# Altium schematic sheet OZ440-SE100-CAR003_Sheet1.SchDoc: mezzanine CAN pour ODROID XU
size A3; Date: 08/04/14; CheckedBy: GS; Author: BM; DocumentNumber: OZ440-SE100-CAR001-SCH01; Revision: 2V; SheetNumber: 1; SheetTotal: 1
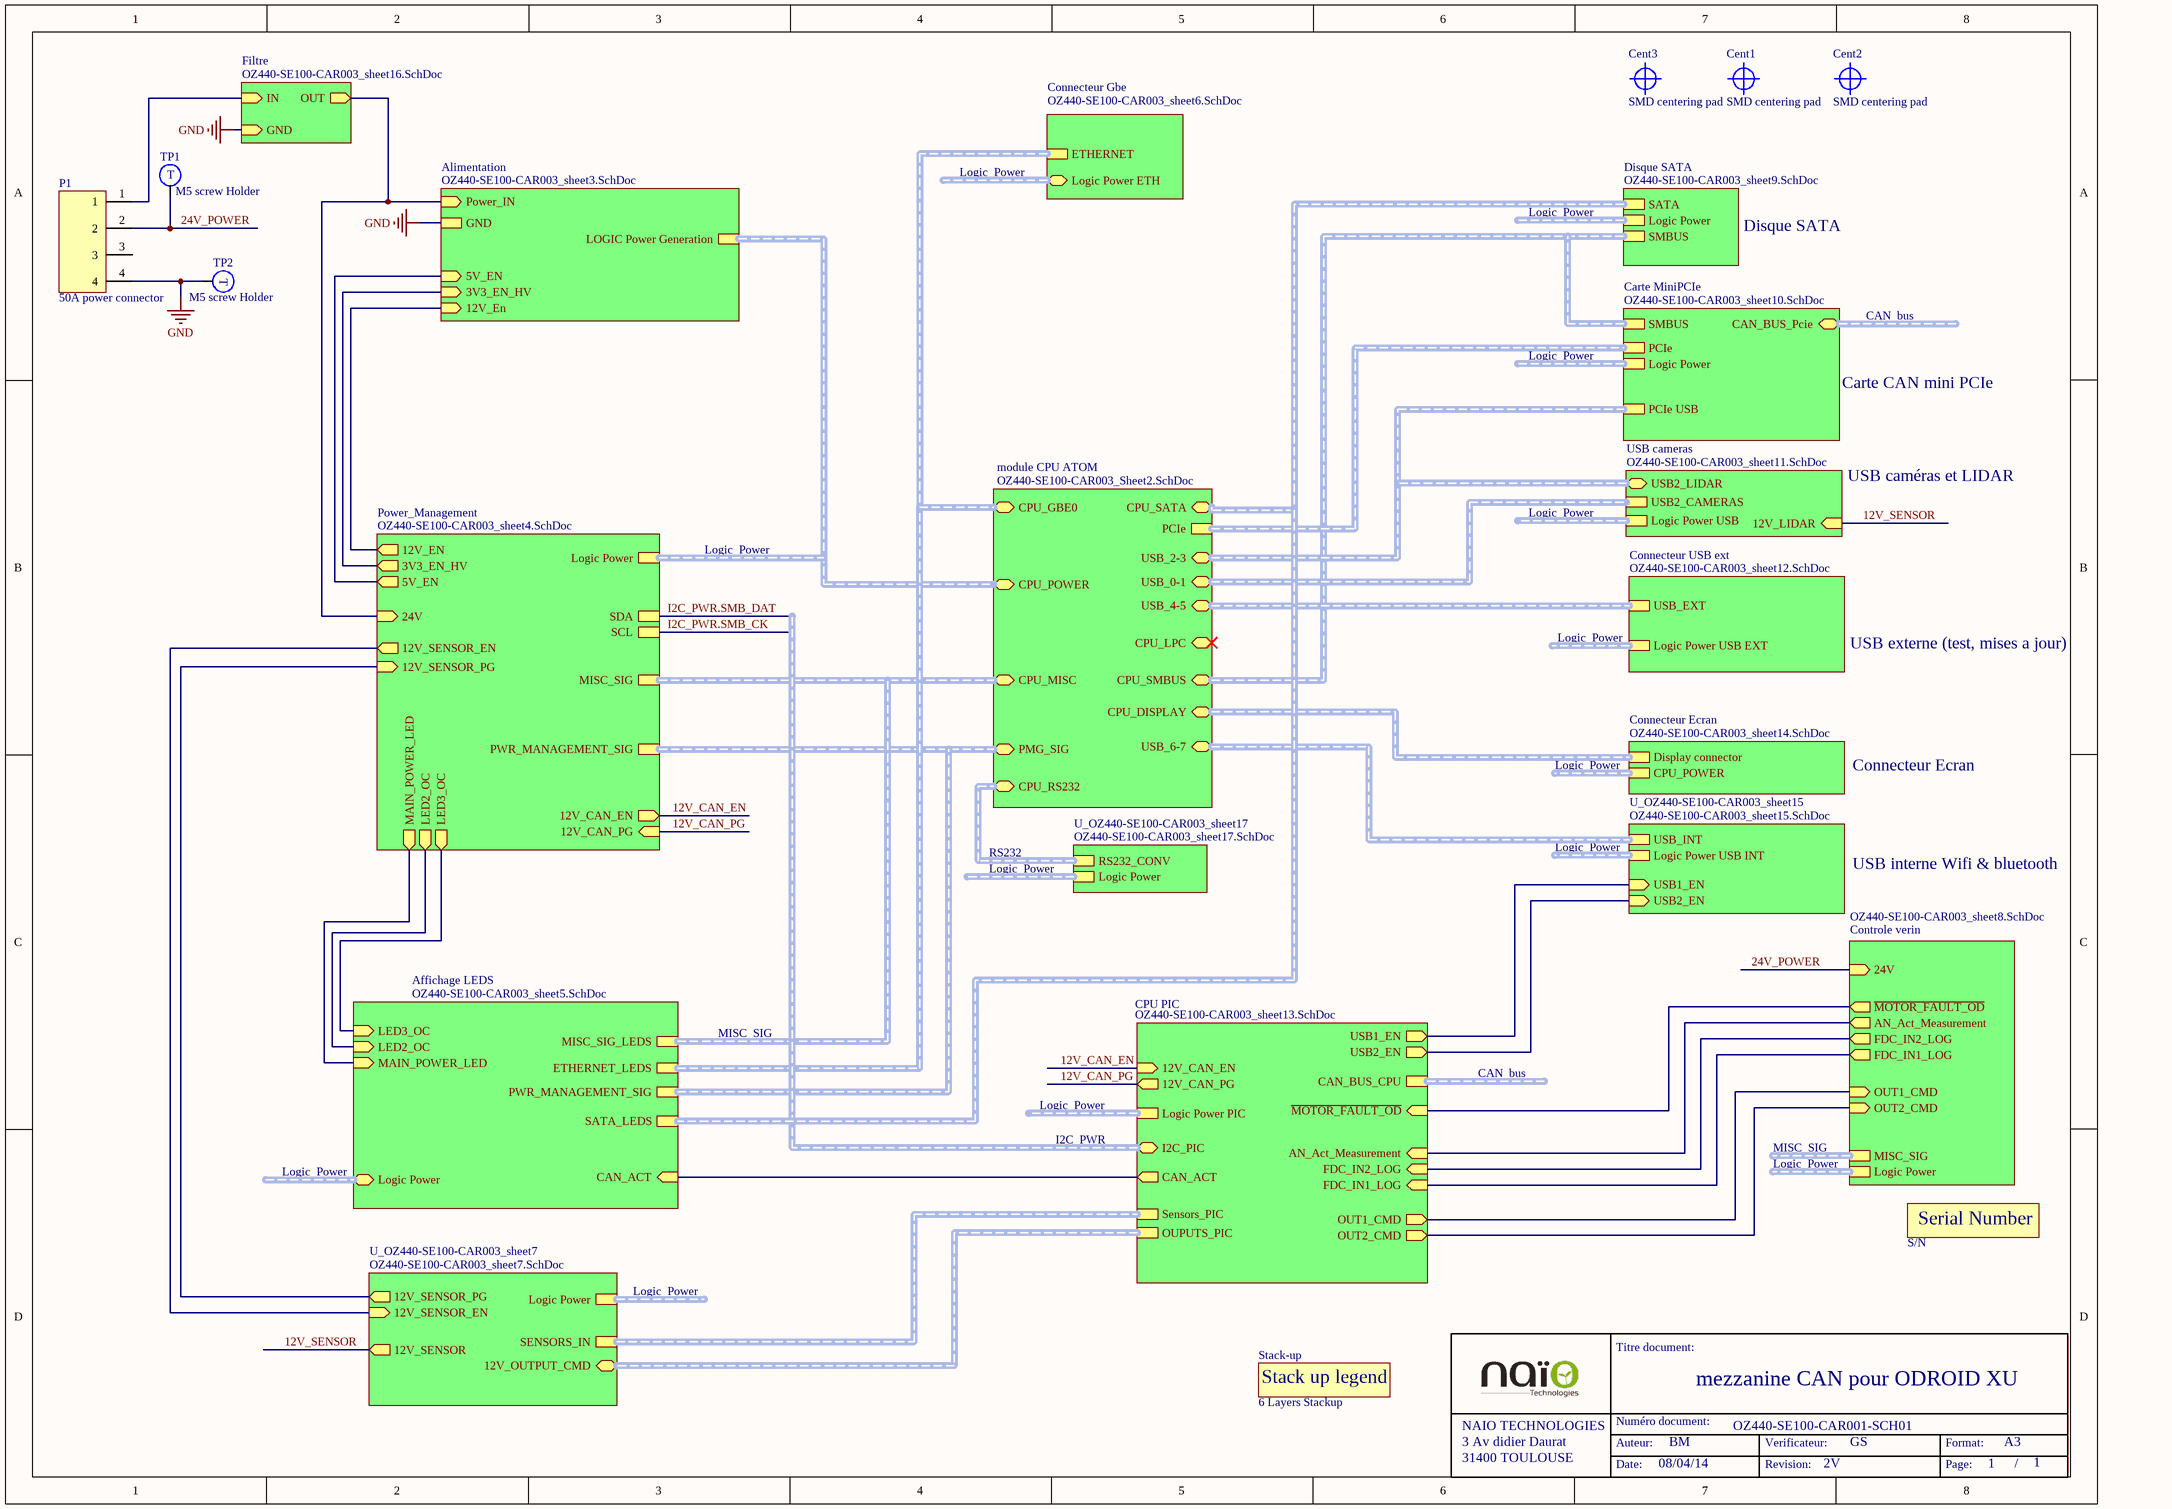
[diagram p0: OZ440-SE100-CAR003_Sheet1.SchDoc]

## Parts
Cent1  MEC-STD-CENTER  [MEC-STD-CENTER]  (value not drawn)  (no BOM)
Cent2  MEC-STD-CENTER  [MEC-STD-CENTER]  (value not drawn)  (no BOM)
Cent3  MEC-STD-CENTER  [MEC-STD-CENTER]  (value not drawn)  (no BOM)
P1  Displayed reference: 50A power connector  [CONN-SPE-428204213_MOLEX]  (hidden comment: CONN-STD-4P_puissance)
SN1  Displayed reference: S/N  [SERIAL_NUMBER-STD]  (hidden comment: SERIAL-NUMBER)
Stack-up  Displayed reference: 6 Layers Stackup  [STACKUP-SPE-6LAYERS]  (hidden comment: STACKUP)  (no BOM)
TP1  Displayed reference: M5 screw Holder  [MEC-SPE-WURTHZ_7460408]  (hidden comment: TP-STD-TEST_POINT)
TP2  Displayed reference: M5 screw Holder  [MEC-SPE-WURTHZ_7460408]  (hidden comment: TP-STD-TEST_POINT)

## Sub-sheets
Affichage LEDS = OZ440-SE100-CAR003_sheet5.SchDoc: SATA_LEDS (harness SATA), ETHERNET_LEDS (harness ETHERNET), MISC_SIG_LEDS (harness MISC_SIG), MAIN_POWER_LED (in), PWR_MANAGEMENT_SIG (harness PWR_MANAGEMENT_SIG), CAN_ACT (in), LED2_OC (in), LED3_OC (in), Logic Power (harness Logic Power)
Alimentation = OZ440-SE100-CAR003_sheet3.SchDoc: Power_IN (in), 12V_En (in), GND, 5V_EN (in), LOGIC Power Generation (harness Logic Power), 3V3_EN_HV (in)
Carte MiniPCIe = OZ440-SE100-CAR003_sheet10.SchDoc: PCIe (harness PCIe), Logic Power (harness Logic Power), SMBUS (harness SMBUS), PCIe USB (harness USB2_DUAL), CAN_BUS_Pcie (harness CAN_BUS)
Connecteur Ecran = OZ440-SE100-CAR003_sheet14.SchDoc: Display connector (harness Display), CPU_POWER (harness Logic Power)
Connecteur Gbe = OZ440-SE100-CAR003_sheet6.SchDoc: ETHERNET (harness ETHERNET), Logic Power ETH (harness Logic Power)
Connecteur USB ext = OZ440-SE100-CAR003_sheet12.SchDoc: USB_EXT (harness USB2_DUAL), Logic Power USB EXT (harness Logic Power)
Controle verin = OZ440-SE100-CAR003_sheet8.SchDoc: 24V (in), OUT1_CMD (in), OUT2_CMD (in), MISC_SIG (harness MISC_SIG), ~{MOTOR_FAULT_OD} (out), Logic Power (harness Logic Power), AN_Act_Measurement (out), FDC_IN2_LOG (out), FDC_IN1_LOG (out)
CPU PIC = OZ440-SE100-CAR003_sheet13.SchDoc: CAN_BUS_CPU (harness CAN_BUS), Logic Power PIC (harness Logic Power), OUPUTS_PIC (harness OUPUTS), Sensors_PIC (harness Sensors), OUT1_CMD (out), OUT2_CMD (out), AN_Act_Measurement (in), FDC_IN2_LOG (in), FDC_IN1_LOG (in), ~{MOTOR_FAULT_OD} (in), I2C_PIC (harness SMBUS), CAN_ACT (out), 12V_CAN_EN (in), 12V_CAN_PG (out), USB1_EN (out), USB2_EN (out)
Disque SATA = OZ440-SE100-CAR003_sheet9.SchDoc: SATA (harness SATA), Logic Power (harness Logic Power), SMBUS (harness SMBUS)
Filtre = OZ440-SE100-CAR003_sheet16.SchDoc: IN (in), OUT (out), GND (in)
module CPU ATOM = OZ440-SE100-CAR003_Sheet2.SchDoc: PCIe (harness PCIe), CPU_POWER (harness Logic Power), CPU_DISPLAY (harness Display), CPU_GBE0 (harness ETHERNET), USB_0-1 (harness USB2_DUAL), USB_2-3 (harness USB2_DUAL), CPU_SATA (harness SATA), CPU_LPC (harness LPC_BUS), PMG_SIG (harness PWR_MANAGEMENT_SIG), CPU_MISC (harness MISC_SIG), CPU_RS232 (harness RS232), CPU_SMBUS (harness SMBUS), USB_4-5 (harness USB2_DUAL), USB_6-7 (harness USB2_DUAL)
Power_Management = OZ440-SE100-CAR003_sheet4.SchDoc: Logic Power (harness Logic Power), SCL, SDA, 24V (in), PWR_MANAGEMENT_SIG (harness PWR_MANAGEMENT_SIG), MISC_SIG (harness MISC_SIG), 3V3_EN_HV (out), 12V_EN (out), 5V_EN (out), 12V_SENSOR_EN (out), 12V_CAN_EN (out), MAIN_POWER_LED (out), LED2_OC (out), LED3_OC (out), 12V_SENSOR_PG (in), 12V_CAN_PG (in)
U_OZ440-SE100-CAR003_sheet7 = OZ440-SE100-CAR003_sheet7.SchDoc: Logic Power (harness Logic Power), 12V_SENSOR_EN (in), 12V_SENSOR_PG (out), SENSORS_IN (harness Sensors), 12V_OUTPUT_CMD (harness OUPUTS), 12V_SENSOR (out)
U_OZ440-SE100-CAR003_sheet15 = OZ440-SE100-CAR003_sheet15.SchDoc: USB_INT (harness USB2_DUAL), Logic Power USB INT (harness Logic Power), USB1_EN (in), USB2_EN (in)
U_OZ440-SE100-CAR003_sheet17 = OZ440-SE100-CAR003_sheet17.SchDoc: RS232_CONV (harness RS232), Logic Power (harness Logic Power)
USB cameras = OZ440-SE100-CAR003_sheet11.SchDoc: Logic Power USB (harness Logic Power), USB2_CAMERAS (harness USB2_DUAL), USB2_LIDAR (harness USB2_DUAL), 12V_LIDAR (in)

## Nets
GND: P1.4 TP2.1(T) ; sheet Alimentation/GND, sheet Filtre/GND
12V_CAN_EN: sheet Power_Management/12V_CAN_EN, sheet CPU PIC/12V_CAN_EN
12V_CAN_PG: sheet Power_Management/12V_CAN_PG, sheet CPU PIC/12V_CAN_PG
12V_SENSOR: sheet U_OZ440-SE100-CAR003_sheet7/12V_SENSOR, sheet USB cameras/12V_LIDAR
24V_POWER: P1.2 TP1.1(T) ; sheet Controle verin/24V
I2C_PWR.SMB_CK: sheet Power_Management/SCL
I2C_PWR.SMB_DAT: sheet Power_Management/SDA
NetP1_1: P1.1 ; sheet Filtre/IN
(unnamed): sheet Alimentation/Power_IN, sheet Power_Management/24V, sheet Filtre/OUT
(unnamed): sheet Alimentation/12V_En, sheet Power_Management/12V_EN
(unnamed): sheet Alimentation/5V_EN, sheet Power_Management/5V_EN
(unnamed): sheet Alimentation/3V3_EN_HV, sheet Power_Management/3V3_EN_HV
(unnamed): sheet Power_Management/12V_SENSOR_EN, sheet U_OZ440-SE100-CAR003_sheet7/12V_SENSOR_EN
(unnamed): sheet Power_Management/MAIN_POWER_LED, sheet Affichage LEDS/MAIN_POWER_LED
(unnamed): sheet Power_Management/LED2_OC, sheet Affichage LEDS/LED2_OC
(unnamed): sheet Power_Management/LED3_OC, sheet Affichage LEDS/LED3_OC
(unnamed): sheet Power_Management/12V_SENSOR_PG, sheet U_OZ440-SE100-CAR003_sheet7/12V_SENSOR_PG
(unnamed): sheet Affichage LEDS/CAN_ACT, sheet CPU PIC/CAN_ACT
(unnamed): sheet Controle verin/OUT1_CMD, sheet CPU PIC/OUT1_CMD
(unnamed): sheet Controle verin/OUT2_CMD, sheet CPU PIC/OUT2_CMD
(unnamed): sheet Controle verin/~{MOTOR_FAULT_OD}, sheet CPU PIC/~{MOTOR_FAULT_OD}
(unnamed): sheet Controle verin/AN_Act_Measurement, sheet CPU PIC/AN_Act_Measurement
(unnamed): sheet Controle verin/FDC_IN2_LOG, sheet CPU PIC/FDC_IN2_LOG
(unnamed): sheet Controle verin/FDC_IN1_LOG, sheet CPU PIC/FDC_IN1_LOG
(unnamed): sheet CPU PIC/USB1_EN, sheet U_OZ440-SE100-CAR003_sheet15/USB1_EN
(unnamed): sheet CPU PIC/USB2_EN, sheet U_OZ440-SE100-CAR003_sheet15/USB2_EN

Not connected (* = marked no-connect by the designer): P1 3

## Buses and harness runs
harness CAN_bus = sheet Carte MiniPCIe/CAN_BUS_Pcie
harness CAN_bus = sheet CPU PIC/CAN_BUS_CPU
harness I2C_PWR = sheet CPU PIC/I2C_PIC
harness Logic_Power = sheet Affichage LEDS/Logic Power
harness Logic_Power = sheet Alimentation/LOGIC Power Generation = sheet module CPU ATOM/CPU_POWER = sheet Power_Management/Logic Power
harness Logic_Power = sheet Carte MiniPCIe/Logic Power
harness Logic_Power = sheet Connecteur Ecran/CPU_POWER
harness Logic_Power = sheet Connecteur Gbe/Logic Power ETH
harness Logic_Power = sheet Connecteur USB ext/Logic Power USB EXT
harness Logic_Power = sheet Controle verin/Logic Power
harness Logic_Power = sheet CPU PIC/Logic Power PIC
harness Logic_Power = sheet Disque SATA/Logic Power
harness Logic_Power = sheet U_OZ440-SE100-CAR003_sheet7/Logic Power
harness Logic_Power = sheet U_OZ440-SE100-CAR003_sheet15/Logic Power USB INT
harness Logic_Power = sheet U_OZ440-SE100-CAR003_sheet17/Logic Power
harness Logic_Power = sheet USB cameras/Logic Power USB
harness MISC_SIG = sheet Affichage LEDS/MISC_SIG_LEDS = sheet module CPU ATOM/CPU_MISC = sheet Power_Management/MISC_SIG
harness MISC_SIG = sheet Controle verin/MISC_SIG
harness RS232 = sheet module CPU ATOM/CPU_RS232 = sheet U_OZ440-SE100-CAR003_sheet17/RS232_CONV
harness sheet Affichage LEDS/ETHERNET_LEDS = sheet Connecteur Gbe/ETHERNET = sheet module CPU ATOM/CPU_GBE0
harness sheet Affichage LEDS/PWR_MANAGEMENT_SIG = sheet module CPU ATOM/PMG_SIG = sheet Power_Management/PWR_MANAGEMENT_SIG
harness sheet Affichage LEDS/SATA_LEDS = sheet Disque SATA/SATA = sheet module CPU ATOM/CPU_SATA
harness sheet Carte MiniPCIe/PCIe = sheet module CPU ATOM/PCIe
harness sheet Carte MiniPCIe/PCIe USB = sheet module CPU ATOM/USB_2-3 = sheet USB cameras/USB2_LIDAR
harness sheet Carte MiniPCIe/SMBUS = sheet Disque SATA/SMBUS = sheet module CPU ATOM/CPU_SMBUS
harness sheet Connecteur Ecran/Display connector = sheet module CPU ATOM/CPU_DISPLAY
harness sheet Connecteur USB ext/USB_EXT = sheet module CPU ATOM/USB_4-5
harness sheet CPU PIC/OUPUTS_PIC = sheet U_OZ440-SE100-CAR003_sheet7/12V_OUTPUT_CMD
harness sheet CPU PIC/Sensors_PIC = sheet U_OZ440-SE100-CAR003_sheet7/SENSORS_IN
harness sheet module CPU ATOM/USB_0-1 = sheet USB cameras/USB2_CAMERAS
harness sheet module CPU ATOM/USB_6-7 = sheet U_OZ440-SE100-CAR003_sheet15/USB_INT

## Notes on the sheet
- Disque SATA
- Carte CAN mini PCIe
- USB caméras et LIDAR
- USB externe (test, mises a jour)
- Connecteur Ecran
- USB interne Wifi & bluetooth
- Titre document:
- NAIO TECHNOLOGIES
- 3 Av didier Daurat
- 31400 TOULOUSE
- Auteur:
- Numéro document:
- Verificateur:
- Format:
- A3
- Date:
- Revision:
- Page:
- /
- (in symbol 6 Layers Stackup) Stack up legend

## Library data of the parts
Cent1-Cent3 = SMD centering pad: Validated: False; Reference: SMD centering pad; Displayed reference: SMD centering pad
P1 = 42820-4213: 4 pin power connector, RA; Manufacturer: Molex; Max Voltage: 600V; Max Current: 50A; Validated: False; Reference: 42820-4213; Footprint description: Thu hole 10mm pitch, RA; Pin Count: 4; Rev: G7; helpURL: http://www.molex.com/pdm_docs/sd/428203213_sd.pdf; Supplier 1: Mouser; Supplier Part Number 1: 538-42820-4213; Supplier 2: Newark; Supplier Part Number 2: 92M0998
SN1 = Serial Number: serial number copper identification; Validated: False; Reference: Serial Number
Stack-up = 6 Layers Stackup: 6 Layers Stackup identification; Validated: False; Reference: 6 Layers Stackup
TP1 TP2 = 7460408: Bush with threaded hole M5; Manufacturer: WURTHZ; Max Current: 160A; Validated: False; Reference: 7460408; Material: CuZn39Pb3; Footprint description: Pressfit Bush with threaded hole M5; Pin Count: 1; helpURL: http://katalog.we-online.de/em/datasheet/7460408.pdf; Supplier 1: Farnell; Supplier Part Number 1: 1821279; Supplier 2: Mouser; Supplier Part Number 2: 710-7460408